# Altium project BPod Panel Due.PrjPcb
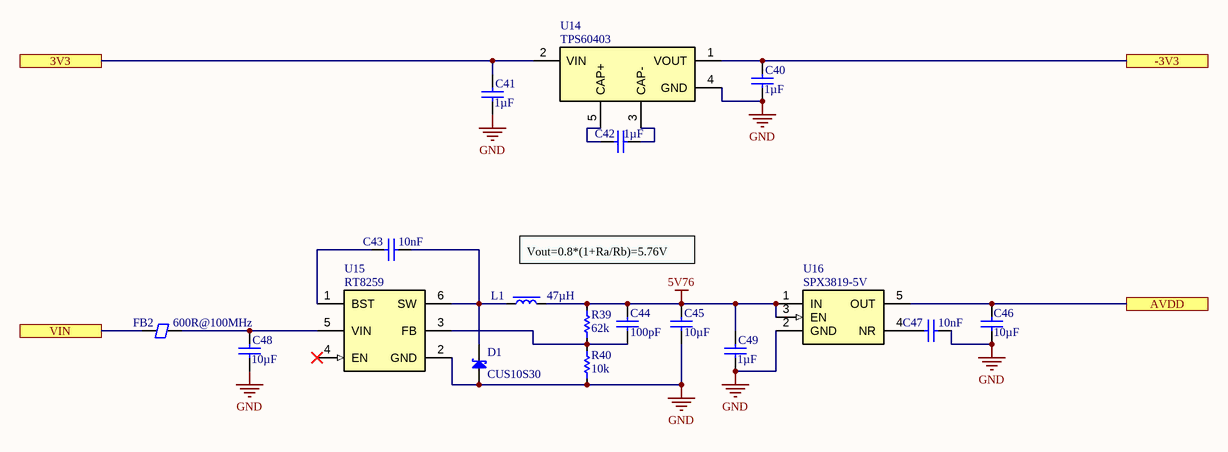
[diagram p0: DC DC.SchDoc]
Project: BPod Panel Due
8 sheets, 274 parts. Net scope: hierarchical (ports join the sheet entries above them; power ports are global).
Board file: BPod Panel Due.PcbDoc
Sheets:
  DC DC.SchDoc
  BPod Panel Due.SchDoc
    DAC Output = DAC Output.SchDoc
    Analog Input A = Analog Input.SchDoc
      Analog Input0 = Analog Input Connector.SchDoc
      Analog Input1 = Analog Input Connector.SchDoc
      Analog Input2 = Analog Input Connector.SchDoc
      Analog Input3 = Analog Input Connector.SchDoc
      Analog Input4 = Analog Input Connector.SchDoc
      Analog Input5 = Analog Input Connector.SchDoc
    Analog Input B = Analog Input.SchDoc
      Analog Input0 = Analog Input Connector.SchDoc
      Analog Input1 = Analog Input Connector.SchDoc
      Analog Input2 = Analog Input Connector.SchDoc
      Analog Input3 = Analog Input Connector.SchDoc
      Analog Input4 = Analog Input Connector.SchDoc
      Analog Input5 = Analog Input Connector.SchDoc
    Digital IO HS = Digital IO HS.SchDoc
    DAC Amplifier = DAC Amplifier.SchDoc
    DAC Offset = DAC Offset.SchDoc

## Sheet DC DC.SchDoc
size 297 x 209 mm; CompanyName: Sainsbury Wellcome Centre; Organization: FabLab; Address1: Sainsbury Wellcome Centre; Address2: 25 Howland Street; Address3: London; Address4: W1T 4JG; DocumentNumber: 4; SheetNumber: 4; SheetTotal: 12; swcgroup: FabLab; Org: Sainsbury Wellcome Centre; Add1: 25 Howland Street; Add2: London; Add3: W1T 4JG; WebAddress: www.sainsburywellcome.org; SheetSize: A4; SheetName: Level Shifter

### Parts
C40  value 1µF  [CAP_CHIP_0603]  (hidden comment: C0603-1uF-50V)
C41  value 1µF  [CAP_CHIP_0603]  (hidden comment: C0603-1uF-50V)
C42  value 1µF  [CAP_CHIP_0603]  (hidden comment: C0603-1uF-50V)
C43  value 10nF  [CAP_CHIP_0603]  (hidden comment: C0603-10nF-50V)
C44  value 100pF  [CAP_CHIP_0603]  (hidden comment: C0603-100pF-50V)
C45  value 10µF  [CAP_CHIP_0603]  (hidden comment: C0603-10uF-35V)
C46  value 10µF  [CAP_CHIP_0603]  (hidden comment: C0603-10uF-25V)
C47  value 10nF  [CAP_CHIP_0603]  (hidden comment: C0603-10nF-50V)
C48  value 10µF  [CAP_CHIP_0603]  (hidden comment: C0603-10uF-35V)
C49  value 1µF  [CAP_CHIP_0603]  (hidden comment: C0603-1uF-50V)
D1  CUS10S30  [SOD323]
FB2  value 600R@100MHz  [FB_CHIP_0805]  (hidden comment: FB0805-600R-0.5A)
L1  value 47µH  [IND_PWR_1210]  (hidden comment: L-PWR-47uH-0.3A)
R39  value 62k  [RES_CHIP_0603]  (hidden comment: R0603-62K)
R40  value 10k  [RES_CHIP_0603]  (hidden comment: R0603-10K)
U14  TPS60403  [SOT23-5]
U15  RT8259  [SOT23-6]
U16  SPX3819-5V  [SOT23-5]

### Ports
3V3, -3V3, AVDD, VIN

### Nets
5V76: C44.2 C45.2 C49.1 L1.2 R39.2 U16.1(IN) U16.3(EN)
GND: C40.2 C41.2 C45.1 C46.1 C47.1 C48.1 C49.2 D1.2(A) R40.1 U14.4(GND) U15.2(GND) U16.2(GND)
NetC40_1: C40.1 U14.1(VOUT) ; port -3V3
NetC41_1: C41.1 U14.2(VIN) ; port 3V3
NetC42_1: C42.1 U14.5(CAP+)
NetC42_2: C42.2 U14.3(CAP-)
NetC43_1: C43.1 D1.1(C) L1.1 U15.6(SW)
NetC43_2: C43.2 U15.1(BST)
NetC44_1: C44.1 R39.1 R40.2 U15.3(FB)
NetC46_2: C46.2 U16.5(OUT) ; port AVDD
NetC47_2: C47.2 U16.4(NR)
NetC48_2: C48.2 FB2.2 U15.5(VIN)
NetFB2_1: FB2.1 ; port VIN

Not connected (* = marked no-connect by the designer): U15 4(EN)*

### Notes on the sheet
- Vout=0.8*(1+Ra/Rb)=5.76V
- FILE
- VARIANT
- DATE
- REVISION
- SHEET
- /
- PROJECT
- SIZE

### Library data of the parts
C40-C42 C49 = CMP-611-0033-11: 0603 Multilayer Ceramic Capacitors MLCC; PartNumber: CL10A105KB8NNNC; Pick&PlaceFootprint: C0603; Voltage Rating: 50V; Dielectric: X5R; Tolerance: 10%; Case/Package: 0603; LCSC Part N.: C15849; RoHS: Yes; Mount: SMD; Capacitor Type: Ceramic
C43 C47 = CMP-611-0022-7: 0603 Multilayer Ceramic Capacitors MLCC; PartNumber: 0603B103K500NT; Tolerance: 10%; Voltage Rating: 50V; Pick&PlaceFootprint: C0603; Dielectric: X7R; RoHS: Yes; Capacitor Type: Ceramic; Mount: SMD; Case/Package: 0603; LCSC Part N.: C57112
C44 = CMP-611-0038-6: 0603 Multilayer Ceramic Capacitors MLCC; PartNumber: CL10C101JB8NNNC; Pick&PlaceFootprint: C0603; Tolerance: 5%; Voltage Rating: 50V; Dielectric: C0G; Case/Package: 0603; LCSC Part N.: C14858; Capacitor Type: Ceramic; Mount: SMD; RoHS: Yes
C45 C48 = CMP-611-0048-3: Ceramic Capacitor, Multilayer, Ceramic, 35V, 20% +Tol, 20% -Tol, X5R, 15% TC, 10uF, Surface Mount, 0603; PartNumber: GRM188R6YA106MA73D; Pick&PlaceFootprint: C0603; Dielectric: X5R; Capacitor Type: Ceramic; Mount: SMD; LCSC Part N.: C194427; RoHS: Yes; Tolerance: 20%; Voltage Rating: 35V; Case/Package: 0603
C46 = CMP-611-0050-6: 0603 Multilayer Ceramic Capacitors MLCC; PartNumber: CL10A106MA8NRNC; Dielectric: X5R; Pick&PlaceFootprint: C0603; Voltage Rating: 25V; Tolerance: 20%; Case/Package: 0603; LCSC Part N.: C96446; RoHS: Yes; Capacitor Type: Ceramic; Mount: SMD
D1 = CMP-821-0013-3: Rectifier Diode, Schottky, 1 Phase, 1 Element, 1A, 30V V(RRM), Silicon; PartNumber: CUS10S30,H3F; Forward Voltage: 370mV; LCSC Part N.: C146335; Max Reverse Voltage: 30V; Mount: Surface Mount; Pick&PlaceFootprint: SOD323; Forward Current: 1A
FB2 = CMP-600-0000-6: Ferrite Chip, 1 Function(s), 0.5A, 2 Pin(s); PartNumber: GZ2012D601TF; DC Resistance-Max: 300mR; Current Rating: 500mA; Footprint: 0805; LCSC Part N.: C1017
L1 = CMP-620-0005-6: Inductor Power Chip Shielded Wirewound 47uH 20% 1MHz Ferrite 0.5A 0.9Ohm DCR 1210 Automotive T/R; PartNumber: LQW32FT470M0HL; RMS Current (Irms): 500mA; Saturation Current: 300mA; DC Resistance (DCR): 900mR; Tolerance: 20%; LCSC Part N.: C907956
R39 = CMP-633-0150-1: 100mW Thick Film Resistors 75V ±100ppm/℃ ±1% 0603 Chip Resistor; PartNumber: 0603WAF6202T5E; Pick&PlaceFootprint: R0603; Number of Resistors: 1; Mount: Surface Mount; Power Rating: 100mW; Tolerance: 1%; Voltage Rating: 75V; Case/Package: 0603; LCSC Part N.: C23221
R40 = CMP-633-0002-26: 100mW Thick Film Resistors 75V ±100ppm/℃ ±1% 0603 Chip Resistor; PartNumber: 0603WAF1002T5E; Number of Resistors: 1; Pick&PlaceFootprint: R0603; Case/Package: 0603; Voltage Rating: 75V; Power Rating: 100mW; LCSC Part N.: C25804; Tolerance: 1%; Mount: Surface Mount
U14 = CMP-970-0067-1: 60mA Charge Pump Voltage Inverter with Fixed 250kHz Operation 5-SOT-23 -40 to 85; PartNumber: TPS60403DBVR; Min Output Voltage: -1.8V; Min Input Voltage: 1.8V; Max Input Voltage: 5.25V; Switcher Configuration: Charge Pump; LCSC Part N.: C11338; Max Output current: 60mA; Switching Frequency: 250kHz
U15 = CMP-970-0044-2: Step-down type Adjustable 800mV~15V 1.2A 4.5V~24V Switching Regulator/Controller; PartNumber: RT8259GJ6; Min Input Voltage: 4.5V; RDS(On): 300mR; Reference Voltage: 0.8V; Switcher Configuration: BUCK; Switching Frequency: 1.4MHz; Max Input Voltage: 24V; Max Output Voltage: 15V; LCSC Part N.: C425775; Pick&PlaceFootprint: SOT23-6; Max Output current: 1.2A
U16 = CMP-970-0066-1: 500mA 70dB Fixed 3.3V Positive electrode 16V LDO; PartNumber: SPX3819M5-L-5-0/TR; Accuracy: 1%; Max Output Current: 800mA; Min Input Voltage: 2.5V; Output Noise: 40uV; Load Regulation: 0.05%; Output Voltage: 5V; Dropout Voltage: 340mV; Quiescent Current: 8uA; Line Regulation: 0.04%; Max Supply Voltage: 16V; PSRR: 70dB; Max Input Voltage: 16V; Output Current: 500mA; LCSC Part N.: C13417; Output Type: Fixed; Pick&PlaceFootprint: SOT23-5

## Sheet BPod Panel Due.SchDoc
size 297 x 209 mm; CompanyName: Sainsbury Wellcome Centre; Organization: FabLab; Address1: Sainsbury Wellcome Centre; Address2: 25 Howland Street; Address3: London; Address4: W1T 4JG; DocumentNumber: 1; SheetNumber: 1; SheetTotal: 12; swcgroup: FabLab; Org: Sainsbury Wellcome Centre; Add1: 25 Howland Street; Add2: London; Add3: W1T 4JG; WebAddress: www.sainsburywellcome.org; SheetSize: A4; SheetName: BPod Panel Due
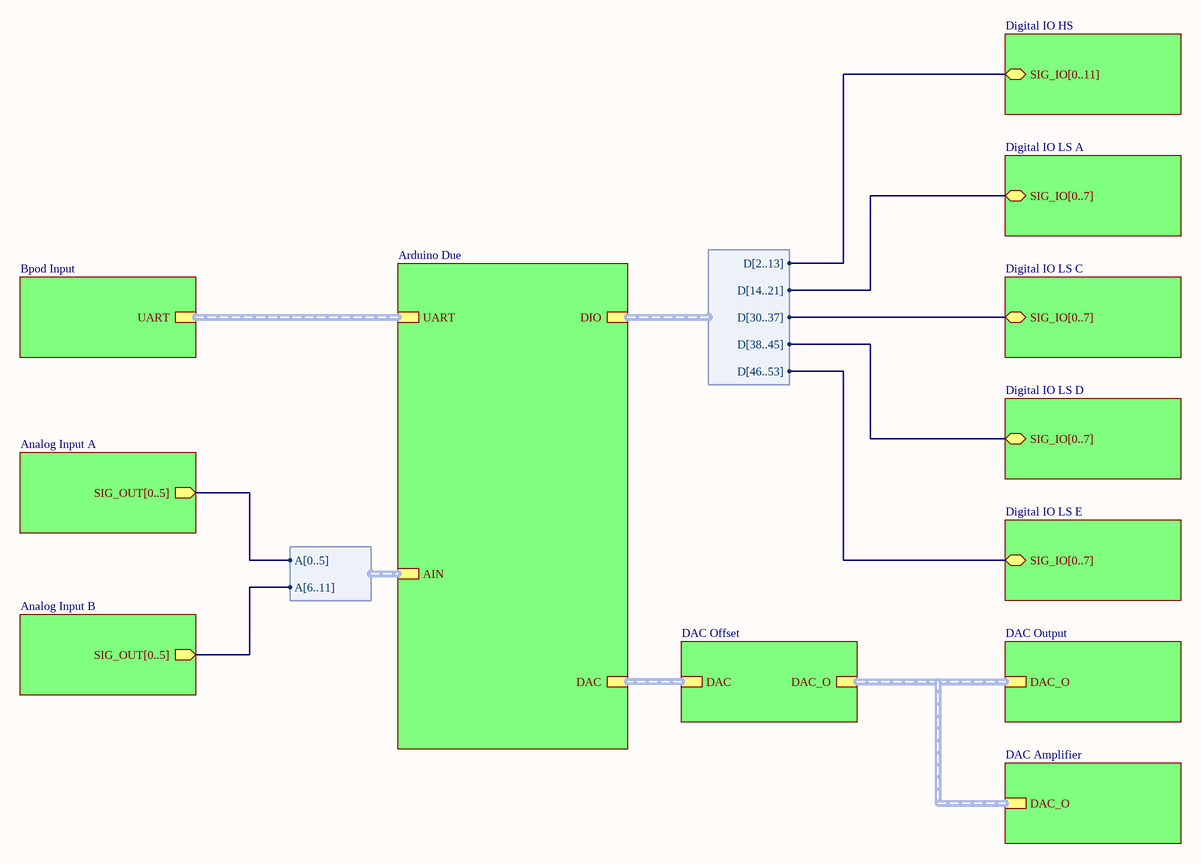
[diagram p1: BPod Panel Due.SchDoc]

### Sub-sheets
Analog Input A = Analog Input.SchDoc: SIG_OUT[0..5] (out)
Analog Input B = Analog Input.SchDoc: SIG_OUT[0..5] (out)
Arduino Due = Arduino Due.SchDoc (file not in this document): AIN (harness AIN), DAC (harness DAC), DIO (harness DIO), UART (harness UART)
Bpod Input = Bpod Input.SchDoc (file not in this document): UART (harness UART)
DAC Amplifier = DAC Amplifier.SchDoc: DAC_O (harness DAC_O)
DAC Offset = DAC Offset.SchDoc: DAC (harness DAC), DAC_O (harness DAC_O)
DAC Output = DAC Output.SchDoc: DAC_O (harness DAC_O)
Digital IO HS = Digital IO HS.SchDoc: SIG_IO[0..11] (bidir)
Digital IO LS A = Digital IO LS.SchDoc (file not in this document): SIG_IO[0..7] (bidir)
Digital IO LS C = Digital IO LS.SchDoc (file not in this document): SIG_IO[0..7] (bidir)
Digital IO LS D = Digital IO LS.SchDoc (file not in this document): SIG_IO[0..7] (bidir)
Digital IO LS E = Digital IO LS.SchDoc (file not in this document): SIG_IO[0..7] (bidir)

### Harnesses
AIN: A[6..11], A[0..5]
DIO: D[2..13], D[14..21], D[30..37], D[38..45], D[46..53]

### Buses and harness runs
harness sheet Arduino Due/DAC = sheet DAC Offset/DAC
harness sheet Arduino Due/UART = sheet Bpod Input/UART
harness sheet DAC Amplifier/DAC_O = sheet DAC Offset/DAC_O = sheet DAC Output/DAC_O

### Notes on the sheet
- FILE
- VARIANT
- DATE
- REVISION
- SHEET
- /
- PROJECT
- SIZE

## Sheet DAC Output.SchDoc
size 297 x 209 mm; CompanyName: Sainsbury Wellcome Centre; Organization: FabLab; Address1: Sainsbury Wellcome Centre; Address2: 25 Howland Street; Address3: London; Address4: W1T 4JG; DocumentNumber: 11; SheetNumber: 11; SheetTotal: 12; swcgroup: FabLab; Org: Sainsbury Wellcome Centre; Add1: 25 Howland Street; Add2: London; Add3: W1T 4JG; WebAddress: www.sainsburywellcome.org; SheetSize: A4; SheetName: Level Shifter
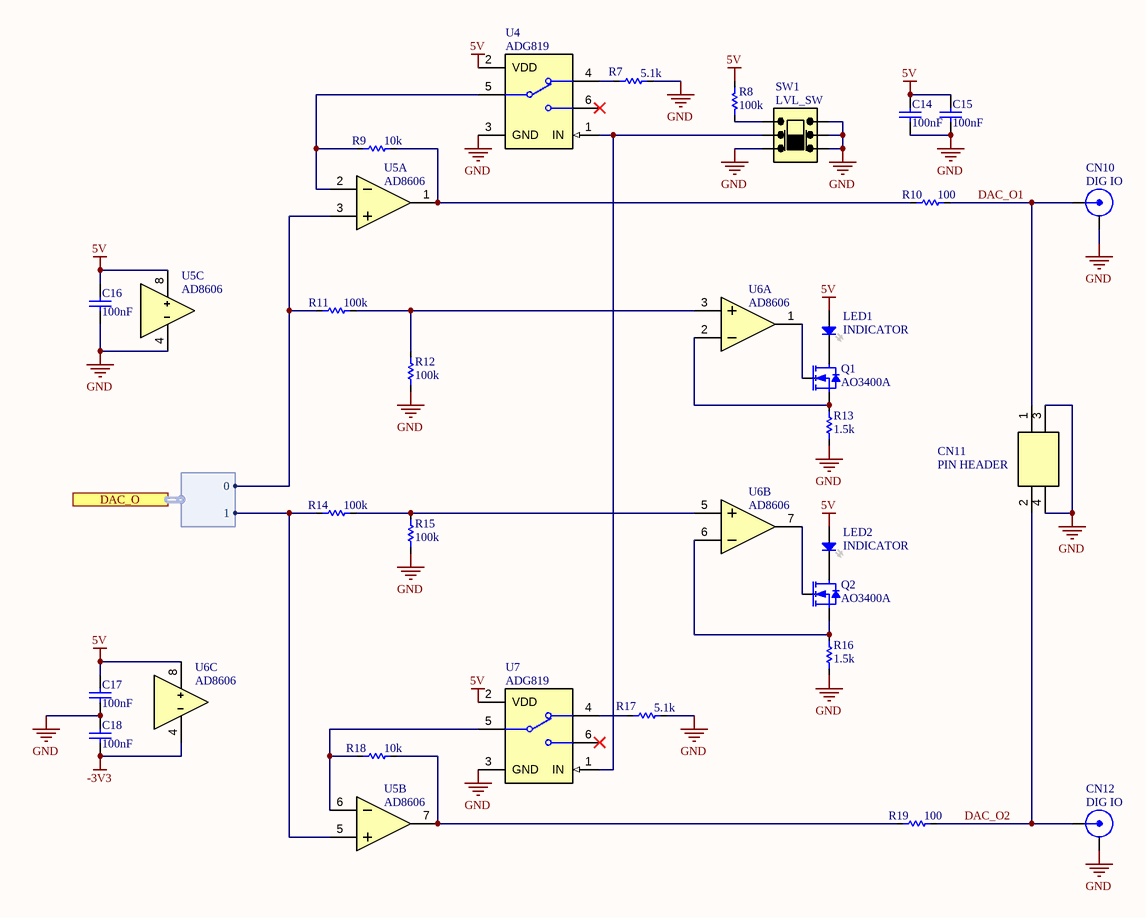
[diagram p2: DAC Output.SchDoc]

### Parts
C14  value 100nF  [CAP_CHIP_0603]  (hidden comment: C0603-100nF-50V)
C15  value 100nF  [CAP_CHIP_0603]  (hidden comment: C0603-100nF-50V)
C16  value 100nF  [CAP_CHIP_0603]  (hidden comment: C0603-100nF-50V)
C17  value 100nF  [CAP_CHIP_0603]  (hidden comment: C0603-100nF-50V)
C18  value 100nF  [CAP_CHIP_0603]  (hidden comment: C0603-100nF-50V)
CN10  DIG IO  [BNC-AMP-112515]
CN11  PIN HEADER  [PIN_2.54_2X2P]
CN12  DIG IO  [BNC-AMP-112515]
LED1  INDICATOR  [LED_CHIP_0805]
LED2  INDICATOR  [LED_CHIP_0805]
Q1  AO3400A  [SOT23]
Q2  AO3400A  [SOT23]
R7  value 5.1k  [RES_CHIP_0603]  (hidden comment: R0603-5K1)
R8  value 100k  [RES_CHIP_0603]  (hidden comment: R0603-100K)
R9  value 10k  [RES_CHIP_0603]  (hidden comment: R0603-10K)
R10  value 100  [RES_CHIP_0603]  (hidden comment: R0603-100R)
R11  value 100k  [RES_CHIP_0603]  (hidden comment: R0603-100K)
R12  value 100k  [RES_CHIP_0603]  (hidden comment: R0603-100K)
R13  value 1.5k  [RES_CHIP_0603]  (hidden comment: R0603-1K5)
R14  value 100k  [RES_CHIP_0603]  (hidden comment: R0603-100K)
R15  value 100k  [RES_CHIP_0603]  (hidden comment: R0603-100K)
R16  value 1.5k  [RES_CHIP_0603]  (hidden comment: R0603-1K5)
R17  value 5.1k  [RES_CHIP_0603]  (hidden comment: R0603-5K1)
R18  value 10k  [RES_CHIP_0603]  (hidden comment: R0603-10K)
R19  value 100  [RES_CHIP_0603]  (hidden comment: R0603-100R)
SW1  LVL_SW  [SW_SLIDE_OS202013MT8]
U4  ADG819  [SOT23-6]
U5  AD8606  [VSSOP8_3X3_0.65E]  (parts A,B,C of 3)
U6  AD8606  [VSSOP8_3X3_0.65E]  (parts A,B,C of 3)
U7  ADG819  [SOT23-6]

### Ports
DAC_O (harness DAC_O)

### Harnesses
DAC_O: 1, 0

### Nets
5V: C14.2 C15.2 C16.2 C17.2 LED1.2(A) LED2.2(A) R8.2 U4.2(VDD) U5.8(V+) U6.8(V+) U7.2(VDD)
-3V3: C18.1 U6.4(V-)
GND: C14.1 C15.1 C16.1 C17.1 C18.2 CN10.2(GND) CN11.3 CN11.4 CN12.2(GND) R7.2 R12.1 R13.1 R15.1 R16.1 R17.2 SW1.1(NCA) SW1.4(NCB) SW1.5(COMB) SW1.6(NOB) U4.3(GND) U5.4(V-) U7.3(GND)
DAC_O1: CN10.1(SIG) CN11.1 R10.2
DAC_O2: CN11.2 CN12.1(SIG) R19.2
DAC_O.0: R11.2 U5.3(A+) ; port DAC_O.0
DAC_O.1: R14.2 U5.5(B+) ; port DAC_O.1
NetLED1_1: LED1.1(K) Q1.3(D)
NetLED2_1: LED2.1(K) Q2.3(D)
NetQ1_1: Q1.1(G) U6.1(AOUT)
NetQ1_2: Q1.2(S) R13.2 U6.2(A-)
NetQ2_1: Q2.1(G) U6.7(BOUT)
NetQ2_2: Q2.2(S) R16.2 U6.6(B-)
NetR7_1: R7.1 U4.4(S1)
NetR8_1: R8.1 SW1.3(NOA)
NetR9_1: R9.1 U4.5(D) U5.2(A-)
NetR9_2: R9.2 R10.1 U5.1(AOUT)
NetR11_1: R11.1 R12.2 U6.3(A+)
NetR14_1: R14.1 R15.2 U6.5(B+)
NetR17_1: R17.1 U7.4(S1)
NetR18_1: R18.1 U5.6(B-) U7.5(D)
NetR18_2: R18.2 R19.1 U5.7(BOUT)
NetSW1_2: SW1.2(COMA) U4.1(IN) U7.1(IN)

Not connected (* = marked no-connect by the designer): U4 6(S2)*; U7 6(S2)*

### Notes on the sheet
- FILE
- VARIANT
- DATE
- REVISION
- SHEET
- /
- PROJECT
- SIZE

### Library data of the parts
C14-C18 = CMP-611-0027-24: 0603 Multilayer Ceramic Capacitors MLCC; PartNumber: CC0603KRX7R9BB104; Tolerance: 10%; Pick&PlaceFootprint: C0603; Dielectric: X7R; Voltage Rating: 50V; Capacitor Type: Ceramic; RoHS: Yes; Mount: SMD; LCSC Part N.: C14663; Case/Package: 0603
CN10 CN12 = CMP-730-0003-11: RF BNC Connector, Female, Board Mount, Solder Terminal, Jack; PartNumber: 112515; Clock Frequency: 4GHz; Characteristic Impedance: 50R; LCSC Part N.: C3176191; Orientation: Straight; Connector Type: BNC; Gender: Female
CN11 = CMP-380-0037-5: Straight Policy 2.5mm 6mm -40℃~+105℃ 3mm 2.54mm Double Row Black Brass 2.54mm Plugin,P=2.54mm Pin Headers; PartNumber: PZ254V-12-4P; Gender: Male; Number of Contacts: 4; Number of Positions: 2; Pitch: 2.54mm; Number of Rows: 2; Mount: Through Hole; Orientation: Straight; LCSC Part N.: C492419
LED1 LED2 = CMP-520-0018-2: White 0805 Light Emitting Diodes (LED) ROHS; PartNumber: KT-0805W; Forward Current: 25mA; Wavelength: 405nm; Pick&PlaceFootprint: LED0805; Forward Voltage: 2.9V; Colour: White; LCSC Part N.: C34499; Mount: Surface Mount
Q1 Q2 = CMP-810-0002-2: 30V 5.7A 26.5mΩ@10V,5.7A 1.4W 1.5V@250uA 1 NChannel SOT-23-3L MOSFETs; Gate-Source Voltage (Vgs): 12V; Pick&PlaceFootprint: SOT-23; RDS(ON): 26.5mR; Switching Time: 34.5ns; LCSC Part N.: C20917; Drain-Source Voltage (Vds): 30V; Mount: Surface Mount; PartNumber: AO3400A; Power Dissipation: 1.4W; Drain Current (Id): 5.7A; Polarity: N Channel
R7 R17 = CMP-633-0090-12: 100mW Thick Film Resistors 75V ±100ppm/℃ ±1% 0603 Chip Resistor; PartNumber: 0603WAF5101T5E; Number of Resistors: 1; Pick&PlaceFootprint: R0603; Voltage Rating: 75V; Case/Package: 0603; Power Rating: 100mW; Tolerance: 1%; LCSC Part N.: C23186; Mount: Surface Mount
R8 R11 R12 R14 R15 = CMP-633-0000-28: 100mW Thick Film Resistors 75V ±100ppm/℃ ±1% 0603 Chip Resistor; PartNumber: 0603WAF1003T5E; Number of Resistors: 1; Pick&PlaceFootprint: R0603; LCSC Part N.: C25803; Mount: Surface Mount; Voltage Rating: 75V; Power Rating: 100mW; Case/Package: 0603; Tolerance: 1%
R9 R18 = CMP-633-0002-26: as R40 on sheet DC DC; Case/Package: 0603; Voltage Rating: 75V; Power Rating: 100mW; LCSC Part N.: C25804; Tolerance: 1%; Mount: Surface Mount
R10 R19 = CMP-633-0094-12: 100mW Thick Film Resistors 75V ±100ppm/℃ ±1% 0603 Chip Resistor; PartNumber: 0603WAF1000T5E; Number of Resistors: 1; Pick&PlaceFootprint: R0603; Case/Package: 0603; Voltage Rating: 75V; Mount: Surface Mount; Tolerance: 1%; LCSC Part N.: C22775; Power Rating: 100mW
R13 R16 = CMP-633-0029-25: 100mW Thick Film Resistors 75V ±100ppm/℃ ±1% 0603 Chip Resistor; PartNumber: 0603WAF1501T5E; Number of Resistors: 1; Pick&PlaceFootprint: R0603; Voltage Rating: 75V; Tolerance: 1%; Mount: Surface Mount; Case/Package: 0603; LCSC Part N.: C22843; Power Rating: 100mW
SW1 = CMP-B00-0028-1: Switch Slide ON ON DPDT Top Slide 0.3A 30VDC 10000Cycles PC Pins Thru-Hole Bulk; PartNumber: OS202013MT8QN1; Switch Travel: 3.2mm; Switch Function: On-On; Voltage Rating (DC): 30V; Throw Configuration: DPDT; Orientation: Straight; LCSC Part N.: C2799227
U4 U7 = CMP-9A0-0003-1: Analog Switch/Analog Multiplexer Single 2: 1 Automotive 6-Pin SOT-23 T/R; PartNumber: ADG819BRTZ-REEL7; Throw Configuration: SPDT; On-State Resistance: 600mR; Number of Channels: 1; Max Supply Voltage: 5.5V; Min Supply Voltage: 1.8V; Bandwidth: 17MHz; LCSC Part N.: C579118
U5 U6 = CMP-941-0002-4: Operational Amplifier, 2 Func, 750uV Offset-Max, CMOS, PDSO8; PartNumber: AD8606ARMZ-REEL; Pick&PlaceFootprint: MSOP-8; Slew Rate: 5V/µs; Min Supply Voltage: 0V; Input Offset Voltage: 65µV; CMRR: 100dB; Max Supply Voltage: 5V; Voltage Drift: 4.5µV/°C; PSRR: 95dB; Quiescent Current: 1mA; Max Supply Current: 80mA; Gain Bandwidth: 10MHz; LCSC Part N.: C459905

## Sheet Analog Input.SchDoc
size 297 x 209 mm; CompanyName: Sainsbury Wellcome Centre; Organization: FabLab; Address1: Sainsbury Wellcome Centre; Address2: 25 Howland Street; Address3: London; Address4: W1T 4JG; DocumentNumber: 5; SheetNumber: 5; SheetTotal: 12; swcgroup: FabLab; Org: Sainsbury Wellcome Centre; Add1: 25 Howland Street; Add2: London; Add3: W1T 4JG; WebAddress: www.sainsburywellcome.org; SheetSize: A4; SheetName: Analog Input A
Used 2 times, as channels Analog Input A, Analog Input B. Parts and nets are listed once, with the designators drawn on the sheet.
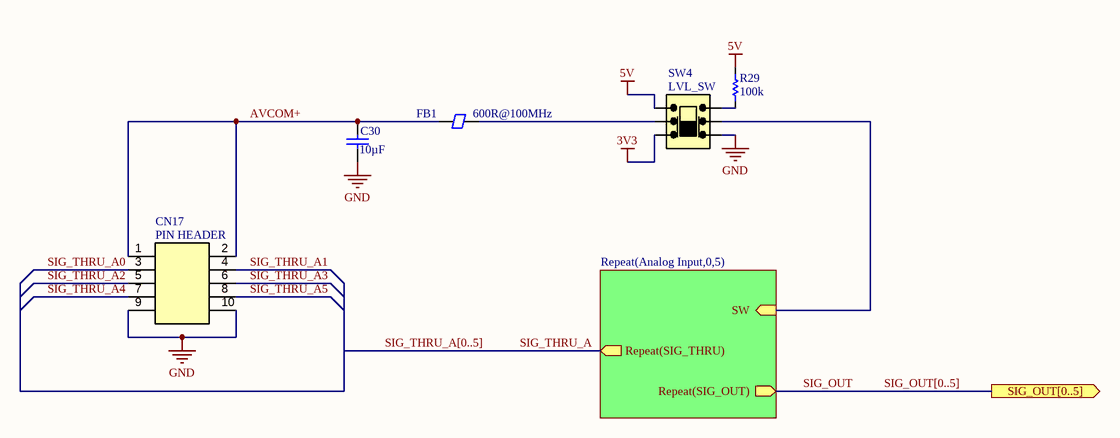
[diagram p3: Analog Input.SchDoc]

### Parts
C30  value 10µF  [CAP_CHIP_0603]  (hidden comment: C0603-10uF-35V)
CN17  PIN HEADER  [PIN_2.54_2X5P]
FB1  value 600R@100MHz  [FB_CHIP_0603]  (hidden comment: FB0603-600R-0.2A)
R29  value 100k  [RES_CHIP_0603]  (hidden comment: R0603-100K)
SW4  LVL_SW  [SW_SLIDE_OS202013MT8]

### Sub-sheets
Repeat(Analog Input,0,5) = Analog Input Connector.SchDoc: SW (in), Repeat(SIG_OUT) (out), Repeat(SIG_THRU) (out)

### Ports
SIG_OUT[0..5] (out)

### Nets
3V3: SW4.4(NCB)
5V: R29.2 SW4.6(NOB)
GND: C30.1 CN17.9 CN17.10 SW4.1(NCA)
AVCOM+: C30.2 CN17.1 CN17.2 FB1.2
SIG_OUT: sheet Repeat(Analog Input,0,5)/Repeat(SIG_OUT)
SIG_THRU_A: sheet Repeat(Analog Input,0,5)/Repeat(SIG_THRU)
SIG_THRU_A0: CN17.3
SIG_THRU_A1: CN17.4
SIG_THRU_A2: CN17.5
SIG_THRU_A3: CN17.6
SIG_THRU_A4: CN17.7
SIG_THRU_A5: CN17.8
NetFB1_1: FB1.1 SW4.5(COMB)
NetR29_1: R29.1 SW4.3(NOA)
NetSW4_2: SW4.2(COMA) ; sheet Repeat(Analog Input,0,5)/SW

### Channels
Analog Input A: designators end in _1
Analog Input B: designators end in _2

### Buses and harness runs
bus SIG_OUT[0..5] = port SIG_OUT[0..5]
bus SIG_THRU_A[0..5]

### Notes on the sheet
- FILE
- VARIANT
- DATE
- REVISION
- SHEET
- /
- PROJECT
- SIZE

### Library data of the parts
C30 = CMP-611-0048-3: as C45 on sheet DC DC; Dielectric: X5R; Capacitor Type: Ceramic; Mount: SMD; LCSC Part N.: C194427; RoHS: Yes; Tolerance: 20%; Voltage Rating: 35V; Case/Package: 0603
CN17 = CMP-380-0034-5: Straight Policy 2.5mm 6mm -40℃~+105℃ 3mm 2.54mm Double Row Black Brass 2.54mm Plugin,P=2.54mm Pin Headers; PartNumber: PZ254V-12-10P; Number of Positions: 5; Number of Contacts: 10; Gender: Male; Orientation: Straight; Pitch: 2.54mm; LCSC Part N.: C492422; Number of Rows: 2; Mount: Through Hole
FB1 = CMP-600-0001-6: Ferrite Chip, 1 Function(s), 0.2A, 2 Pin(s); PartNumber: GZ1608D601TF; Current Rating: 200mA; DC Resistance-Max: 450mR; Footprint: 0603; LCSC Part N.: C1002
R29 = CMP-633-0000-28: as R8 on sheet DAC Output; LCSC Part N.: C25803; Mount: Surface Mount; Voltage Rating: 75V; Power Rating: 100mW; Case/Package: 0603; Tolerance: 1%
SW4 = CMP-B00-0028-1: as SW1 on sheet DAC Output; Throw Configuration: DPDT; Orientation: Straight; LCSC Part N.: C2799227

## Sheet Analog Input Connector.SchDoc
size 297 x 209 mm; CompanyName: Sainsbury Wellcome Centre; Organization: FabLab; Address1: Sainsbury Wellcome Centre; Address2: 25 Howland Street; Address3: London; Address4: W1T 4JG; DocumentNumber: 6; SheetNumber: 6; SheetTotal: 12; swcgroup: FabLab; Org: Sainsbury Wellcome Centre; Add1: 25 Howland Street; Add2: London; Add3: W1T 4JG; WebAddress: www.sainsburywellcome.org; SheetSize: A4; SheetName: Analog Input A
Used 12 times, as channels Analog Input A/Analog Input0, Analog Input A/Analog Input1, Analog Input A/Analog Input2, Analog Input A/Analog Input3, Analog Input A/Analog Input4, Analog Input A/Analog Input5, Analog Input B/Analog Input0, Analog Input B/Analog Input1, Analog Input B/Analog Input2, Analog Input B/Analog Input3, Analog Input B/Analog Input4, Analog Input B/Analog Input5. Parts and nets are listed once, with the designators drawn on the sheet.
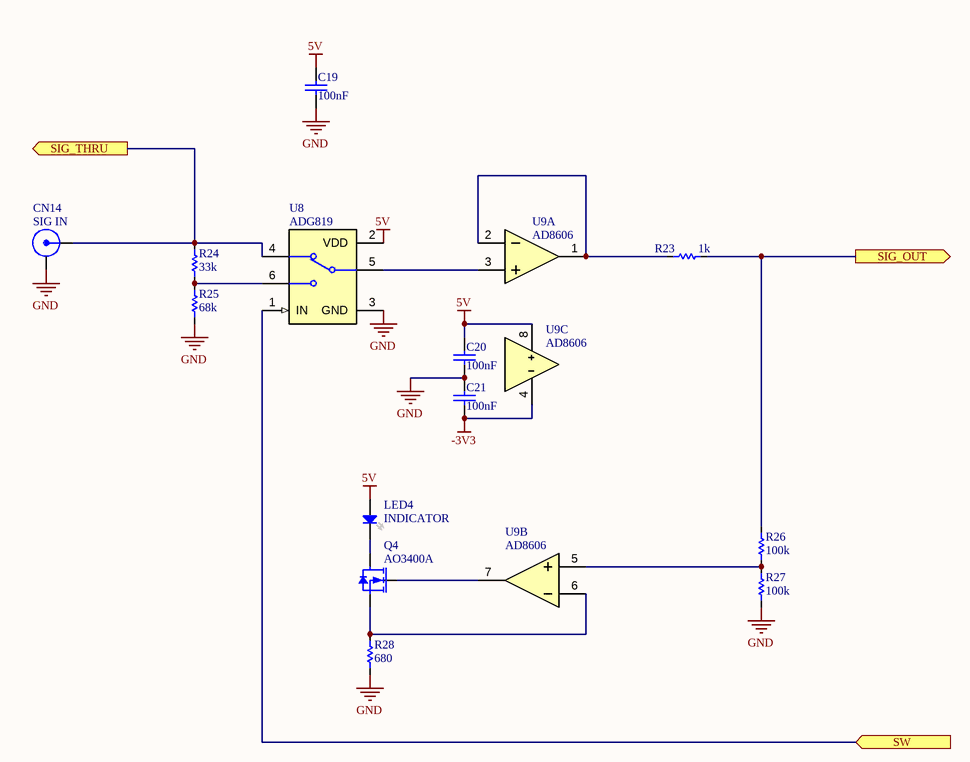
[diagram p4: Analog Input Connector.SchDoc]

### Parts
C19  value 100nF  [CAP_CHIP_0603]  (hidden comment: C0603-100nF-50V)
C20  value 100nF  [CAP_CHIP_0603]  (hidden comment: C0603-100nF-50V)
C21  value 100nF  [CAP_CHIP_0603]  (hidden comment: C0603-100nF-50V)
CN14  SIG IN  [BNC-AMP-112515]
LED4  INDICATOR  [LED_CHIP_0805]
Q4  AO3400A  [SOT23]
R23  value 1k  [RES_CHIP_0603]  (hidden comment: R0603-1K)
R24  value 33k  [RES_CHIP_0603]  (hidden comment: R0603-33K)
R25  value 68k  [RES_CHIP_0603]  (hidden comment: R0603-68K)
R26  value 100k  [RES_CHIP_0603]  (hidden comment: R0603-100K)
R27  value 100k  [RES_CHIP_0603]  (hidden comment: R0603-100K)
R28  value 680  [RES_CHIP_0603]  (hidden comment: R0603-680R)
U8  ADG819  [SOT23-6]
U9  AD8606  [VSSOP8_3X3_0.65E]  (parts A,B,C of 3)

### Ports
SIG_OUT (out), SIG_THRU (out), SW (in)

### Nets
5V: C19.2 C20.2 LED4.2(A) U8.2(VDD) U9.8(V+)
-3V3: C21.1 U9.4(V-)
GND: C19.1 C20.1 C21.2 CN14.2(GND) R25.1 R27.1 R28.1 U8.3(GND)
SIG_OUT: R23.2 R26.2 ; port SIG_OUT
SIG_THRU: CN14.1(SIG) R24.2 U8.4(S1) ; port SIG_THRU
SW: U8.1(IN) ; port SW
NetLED4_1: LED4.1(K) Q4.3(D)
NetQ4_1: Q4.1(G) U9.7(BOUT)
NetQ4_2: Q4.2(S) R28.2 U9.6(B-)
NetR23_1: R23.1 U9.1(AOUT) U9.2(A-)
NetR24_1: R24.1 R25.2 U8.6(S2)
NetR26_1: R26.1 R27.2 U9.5(B+)
NetU8_5: U8.5(D) U9.3(A+)

### Channels
Analog Input A/Analog Input0: designators end in _1; ports SIG_OUT=SIG_OUT0_Analog Input A SIG_THRU=SIG_THRU_A0_Analog Input A SW=NetSW4_1_2
Analog Input A/Analog Input1: designators end in _2; ports SIG_OUT=SIG_OUT1_Analog Input A SIG_THRU=SIG_THRU_A1_Analog Input A SW=NetSW4_1_2
Analog Input A/Analog Input2: designators end in _3; ports SIG_OUT=SIG_OUT2_Analog Input A SIG_THRU=SIG_THRU_A2_Analog Input A SW=NetSW4_1_2
Analog Input A/Analog Input3: designators end in _4; ports SIG_OUT=SIG_OUT3_Analog Input A SIG_THRU=SIG_THRU_A3_Analog Input A SW=NetSW4_1_2
Analog Input A/Analog Input4: designators end in _5; ports SIG_OUT=SIG_OUT4_Analog Input A SIG_THRU=SIG_THRU_A4_Analog Input A SW=NetSW4_1_2
Analog Input A/Analog Input5: designators end in _6; ports SIG_OUT=SIG_OUT5_Analog Input A SIG_THRU=SIG_THRU_A5_Analog Input A SW=NetSW4_1_2
Analog Input B/Analog Input0: designators end in _7; ports SIG_OUT=SIG_OUT0_Analog Input B SIG_THRU=SIG_THRU_A0_Analog Input B SW=NetSW4_2_2
Analog Input B/Analog Input1: designators end in _8; ports SIG_OUT=SIG_OUT1_Analog Input B SIG_THRU=SIG_THRU_A1_Analog Input B SW=NetSW4_2_2
Analog Input B/Analog Input2: designators end in _9; ports SIG_OUT=SIG_OUT2_Analog Input B SIG_THRU=SIG_THRU_A2_Analog Input B SW=NetSW4_2_2
Analog Input B/Analog Input3: designators end in _10; ports SIG_OUT=SIG_OUT3_Analog Input B SIG_THRU=SIG_THRU_A3_Analog Input B SW=NetSW4_2_2
Analog Input B/Analog Input4: designators end in _11; ports SIG_OUT=SIG_OUT4_Analog Input B SIG_THRU=SIG_THRU_A4_Analog Input B SW=NetSW4_2_2
Analog Input B/Analog Input5: designators end in _12; ports SIG_OUT=SIG_OUT5_Analog Input B SIG_THRU=SIG_THRU_A5_Analog Input B SW=NetSW4_2_2

### Notes on the sheet
- FILE
- VARIANT
- DATE
- REVISION
- SHEET
- /
- PROJECT
- SIZE

### Library data of the parts
C19-C21 = CMP-611-0027-24: as C14 on sheet DAC Output; Capacitor Type: Ceramic; RoHS: Yes; Mount: SMD; LCSC Part N.: C14663; Case/Package: 0603
CN14 = CMP-730-0003-11: as CN10 on sheet DAC Output; LCSC Part N.: C3176191; Orientation: Straight; Connector Type: BNC; Gender: Female
LED4 = CMP-520-0018-2: as LED1 on sheet DAC Output; Colour: White; LCSC Part N.: C34499; Mount: Surface Mount
Q4 = CMP-810-0002-2: as Q1 on sheet DAC Output; LCSC Part N.: C20917; Drain-Source Voltage (Vds): 30V; Mount: Surface Mount; PartNumber: AO3400A; Power Dissipation: 1.4W; Drain Current (Id): 5.7A; Polarity: N Channel
R23 = CMP-633-0013-26: 100mW Thick Film Resistors 75V ±100ppm/℃ ±1% 0603 Chip Resistor; PartNumber: 0603WAF1001T5E; Pick&PlaceFootprint: R0603; Number of Resistors: 1; Voltage Rating: 75V; Case/Package: 0603; Tolerance: 1%; Mount: Surface Mount; LCSC Part N.: C21190; Power Rating: 100mW
R24 = CMP-633-0105-10: 100mW Thick Film Resistors 75V ±100ppm/℃ ±1% 0603 Chip Resistor; PartNumber: 0603WAF3302T5E; Pick&PlaceFootprint: R0603; Number of Resistors: 1; Tolerance: 1%; Mount: Surface Mount; Voltage Rating: 75V; LCSC Part N.: C4216; Case/Package: 0603; Power Rating: 100mW
R25 = CMP-633-0107-3: 100mW Thick Film Resistors 75V ±100ppm/℃ ±1% 0603 Chip Resistor; PartNumber: 0603WAF6802T5E; Pick&PlaceFootprint: R0603; Number of Resistors: 1; Tolerance: 1%; LCSC Part N.: C23231; Case/Package: 0603; Power Rating: 100mW; Mount: Surface Mount; Voltage Rating: 75V
R26 R27 = CMP-633-0000-28: as R8 on sheet DAC Output; LCSC Part N.: C25803; Mount: Surface Mount; Voltage Rating: 75V; Power Rating: 100mW; Case/Package: 0603; Tolerance: 1%
R28 = CMP-633-0087-12: 100mW Thick Film Resistors 75V ±100ppm/℃ ±1% 0603 Chip Resistor; PartNumber: 0603WAF6800T5E; Number of Resistors: 1; Pick&PlaceFootprint: R0603; Voltage Rating: 75V; Case/Package: 0603; Power Rating: 100mW; Tolerance: 1%; Mount: Surface Mount; LCSC Part N.: C23228
U8 = CMP-9A0-0003-1: as U4 on sheet DAC Output; LCSC Part N.: C579118
U9 = CMP-941-0002-4: as U5 on sheet DAC Output; LCSC Part N.: C459905

## Sheet Digital IO HS.SchDoc
size 297 x 209 mm; CompanyName: Sainsbury Wellcome Centre; Organization: FabLab; Address1: Sainsbury Wellcome Centre; Address2: 25 Howland Street; Address3: London; Address4: W1T 4JG; DocumentNumber: 7; SheetNumber: 7; SheetTotal: 12; swcgroup: FabLab; Org: Sainsbury Wellcome Centre; Add1: 25 Howland Street; Add2: London; Add3: W1T 4JG; WebAddress: www.sainsburywellcome.org; SheetSize: A4; SheetName: Level Shifter
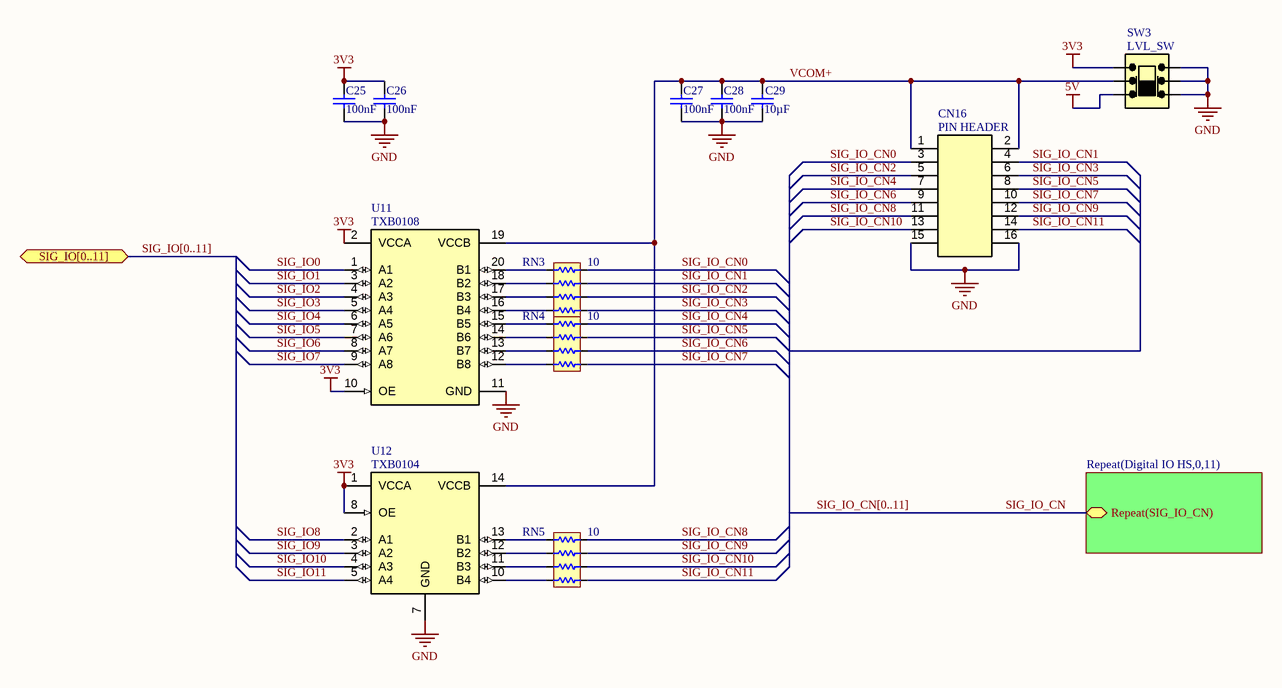
[diagram p5: Digital IO HS.SchDoc]

### Parts
C25  value 100nF  [CAP_CHIP_0603]  (hidden comment: C0603-100nF-50V)
C26  value 100nF  [CAP_CHIP_0603]  (hidden comment: C0603-100nF-50V)
C27  value 100nF  [CAP_CHIP_0603]  (hidden comment: C0603-100nF-50V)
C28  value 100nF  [CAP_CHIP_0603]  (hidden comment: C0603-100nF-50V)
C29  value 10µF  [CAP_CHIP_0603]  (hidden comment: C0603-10uF-35V)
CN16  PIN HEADER  [PIN_2.54_2X8P]
RN3  value 10  [RES_ARRAY_0603]  (hidden comment: RN0603-10R)
RN4  value 10  [RES_ARRAY_0603]  (hidden comment: RN0603-10R)
RN5  value 10  [RES_ARRAY_0603]  (hidden comment: RN0603-10R)
SW3  LVL_SW  [SW_SLIDE_OS202013MT8]
U11  TXB0108  [TSSOP20_6.5X4.4_0.65E]
U12  TXB0104  [TSSOP14_5X4.4_0.65E]

### Sub-sheets
Repeat(Digital IO HS,0,11) = Digital IO Connector.SchDoc (file not in this document): Repeat(SIG_IO_CN) (bidir)

### Ports
SIG_IO[0..11] (bidir)

### Nets
3V3: C25.2 C26.2 SW3.3(NOA) U11.2(VCCA) U11.10(OE) U12.1(VCCA) U12.8(OE)
5V: SW3.1(NCA)
GND: C25.1 C26.1 C27.1 C28.1 C29.1 CN16.15 CN16.16 SW3.4(NCB) SW3.5(COMB) SW3.6(NOB) U11.11(GND) U12.7(GND)
SIG_IO0: U11.1(A1)
SIG_IO1: U11.3(A2)
SIG_IO2: U11.4(A3)
SIG_IO3: U11.5(A4)
SIG_IO4: U11.6(A5)
SIG_IO5: U11.7(A6)
SIG_IO6: U11.8(A7)
SIG_IO7: U11.9(A8)
SIG_IO8: U12.2(A1)
SIG_IO9: U12.3(A2)
SIG_IO10: U12.4(A3)
SIG_IO11: U12.5(A4)
SIG_IO_CN: sheet Repeat(Digital IO HS,0,11)/Repeat(SIG_IO_CN)
SIG_IO_CN0: CN16.3 RN3.8
SIG_IO_CN1: CN16.4 RN3.7
SIG_IO_CN2: CN16.5 RN3.6
SIG_IO_CN3: CN16.6 RN3.5
SIG_IO_CN4: CN16.7 RN4.8
SIG_IO_CN5: CN16.8 RN4.7
SIG_IO_CN6: CN16.9 RN4.6
SIG_IO_CN7: CN16.10 RN4.5
SIG_IO_CN8: CN16.11 RN5.8
SIG_IO_CN9: CN16.12 RN5.7
SIG_IO_CN10: CN16.13 RN5.6
SIG_IO_CN11: CN16.14 RN5.5
VCOM+: C27.2 C28.2 C29.2 CN16.1 CN16.2 SW3.2(COMA) U11.19(VCCB) U12.14(VCCB)
NetRN3_1: RN3.1 U11.20(B1)
NetRN3_2: RN3.2 U11.18(B2)
NetRN3_3: RN3.3 U11.17(B3)
NetRN3_4: RN3.4 U11.16(B4)
NetRN4_1: RN4.1 U11.15(B5)
NetRN4_2: RN4.2 U11.14(B6)
NetRN4_3: RN4.3 U11.13(B7)
NetRN4_4: RN4.4 U11.12(B8)
NetRN5_1: RN5.1 U12.13(B1)
NetRN5_2: RN5.2 U12.12(B2)
NetRN5_3: RN5.3 U12.11(B3)
NetRN5_4: RN5.4 U12.10(B4)

### Buses and harness runs
bus SIG_IO[0..11] = port SIG_IO[0..11]
bus SIG_IO_CN[0..11]

### Notes on the sheet
- FILE
- VARIANT
- DATE
- REVISION
- SHEET
- /
- PROJECT
- SIZE

### Library data of the parts
C25-C28 = CMP-611-0027-24: as C14 on sheet DAC Output; Capacitor Type: Ceramic; RoHS: Yes; Mount: SMD; LCSC Part N.: C14663; Case/Package: 0603
C29 = CMP-611-0048-3: as C45 on sheet DC DC; Dielectric: X5R; Capacitor Type: Ceramic; Mount: SMD; LCSC Part N.: C194427; RoHS: Yes; Tolerance: 20%; Voltage Rating: 35V; Case/Package: 0603
CN16 = CMP-380-0031-5: Straight Policy 2.5mm 6mm -40℃~+105℃ 3mm 2.54mm Double Row Black Brass 2.54mm Plugin,P=2.54mm Pin Headers; PartNumber: PZ254V-12-16P; Number of Contacts: 16; Gender: Male; Number of Positions: 8; Mount: Through Hole; Pitch: 2.54mm; Number of Rows: 2; LCSC Part N.: C492425; Orientation: Straight
RN3-RN5 = CMP-633-0183-1: Array/Network Resistor, Jumper, Metal Glaze/thick Film, 10ohm, 50V, 5% +/-Tol, -200,200ppm/Cel, Surface Mount, 1206; PartNumber: 4D03WGJ0100T5E; Element Power Dissipation: 62.5mW; Number of Resistors: 4; Pick&PlaceFootprint: R0603x4; LCSC Part N.: C11993; Voltage Rating: 50V; Power Rating: 62.5mW; Tolerance: 5%; Case/Package: 0612; Mount: SMD; RoHS: Yes
SW3 = CMP-B00-0028-1: as SW1 on sheet DAC Output; Throw Configuration: DPDT; Orientation: Straight; LCSC Part N.: C2799227
U11 = CMP-950-0024-1: 8-Bit Bidirectional Voltage-Level Shifter with Auto Direction Sensing and +/-15-kV ESD Protect 20-TSSOP -40 to 85; PartNumber: TXB0108PWR; Data Rate: 100Mbps; Output Type: 3-STATE; Number of Channels: 8; Min Supply Voltage: 1.2V; Max Supply Voltage: 5.5V; Propagation Delay: 4ns; Channel Type: Bidirectional; LCSC Part N.: C53406
U12 = CMP-950-0006-5: 4-Bit Bidirectional Voltage-Level Shifter with Auto Direction Sensing and +/-15 kV ESD Protect 14-TSSOP -40 to 85; Max Supply Voltage: 5.5V; Min Supply Voltage: 1.2V; Propagation Delay: 31ns; LCSC Part N.: C60708; Channel Type: Bidirectional; PartNumber: TXB0104PWR

## Sheet DAC Amplifier.SchDoc
size 297 x 209 mm; CompanyName: Sainsbury Wellcome Centre; Organization: FabLab; Address1: Sainsbury Wellcome Centre; Address2: 25 Howland Street; Address3: London; Address4: W1T 4JG; DocumentNumber: 12; SheetNumber: 12; SheetTotal: 12; swcgroup: FabLab; Org: Sainsbury Wellcome Centre; Add1: 25 Howland Street; Add2: London; Add3: W1T 4JG; WebAddress: www.sainsburywellcome.org; SheetSize: A4; SheetName: Level Shifter
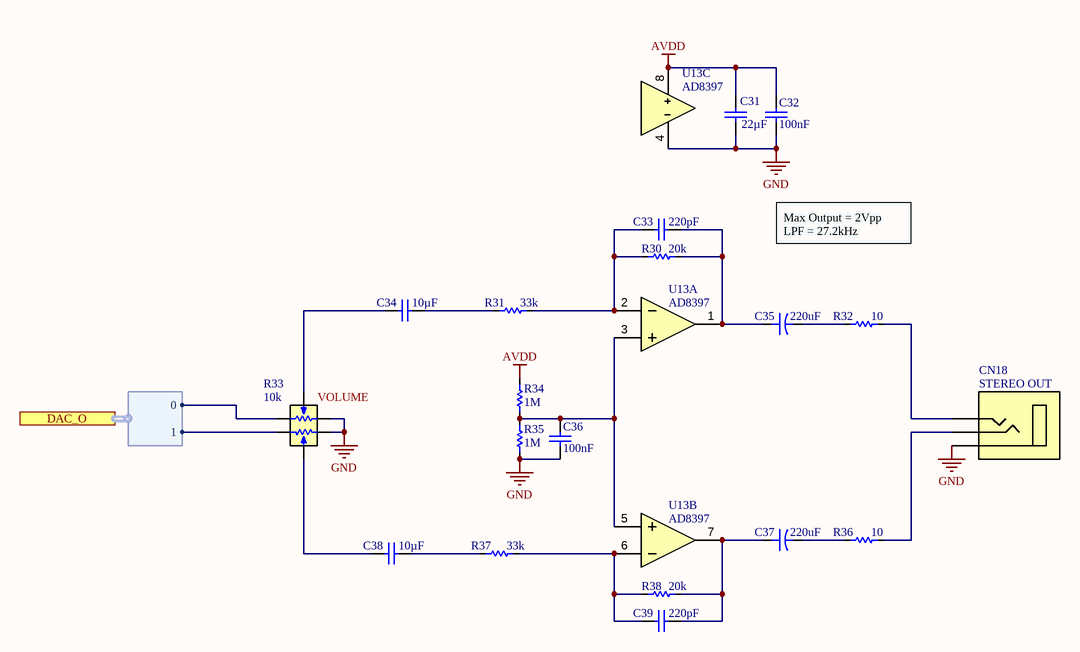
[diagram p6: DAC Amplifier.SchDoc]

### Parts
C31  value 22µF  [CAP_CHIP_0805]  (hidden comment: C0805-22uF-25V)
C32  value 100nF  [CAP_CHIP_0603]  (hidden comment: C0603-100nF-50V)
C33  value 220pF  [CAP_CHIP_0603]  (hidden comment: C0603-220pF-50V)
C34  value 10µF  [CAP_CHIP_0603]  (hidden comment: C0603-10uF-25V)
C35  value 220uF  [ECAP_SMD_6.3X5.4]  (hidden comment: EC63-220uF-10V)
C36  value 100nF  [CAP_CHIP_0603]  (hidden comment: C0603-100nF-50V)
C37  value 220uF  [ECAP_SMD_6.3X5.4]  (hidden comment: EC63-220uF-10V)
C38  value 10µF  [CAP_CHIP_0603]  (hidden comment: C0603-10uF-25V)
C39  value 220pF  [CAP_CHIP_0603]  (hidden comment: C0603-220pF-50V)
CN18  STEREO OUT  [PJ-3920]
R30  value 20k  [RES_CHIP_0603]  (hidden comment: R0603-20K)
R31  value 33k  [RES_CHIP_0603]  (hidden comment: R0603-33K)
R32  value 10  [RES_CHIP_1206]  (hidden comment: R1206-10R)
R33  VOLUME  value 10k  [VR_RK12L12C]
R34  value 1M  [RES_CHIP_0603]  (hidden comment: R0603-1M)
R35  value 1M  [RES_CHIP_0603]  (hidden comment: R0603-1M)
R36  value 10  [RES_CHIP_1206]  (hidden comment: R1206-10R)
R37  value 33k  [RES_CHIP_0603]  (hidden comment: R0603-33K)
R38  value 20k  [RES_CHIP_0603]  (hidden comment: R0603-20K)
U13  AD8397  [SOIC8_AD8397]  (parts A,B,C of 3)

### Ports
DAC_O (harness DAC_O)

### Harnesses
DAC_O: 1, 0

### Nets
AVDD: C31.2 C32.2 R34.2 U13.8(V+)
GND: C31.1 C32.1 C36.1 CN18.1(S) R33.1(TOP_A) R33.4(TOP_B) R35.1 U13.4(V-)
DAC_O.0: R33.2(BOT_A) ; port DAC_O.0
DAC_O.1: R33.5(BOT_B) ; port DAC_O.1
NetC33_1: C33.1 R30.1 R31.2 U13.2(A-)
NetC33_2: C33.2 C35.1 R30.2 U13.1(AOUT)
NetC34_1: C34.1 R33.3(TAP_A)
NetC34_2: C34.2 R31.1
NetC35_2: C35.2 R32.1
NetC36_2: C36.2 R34.1 R35.2 U13.3(A+) U13.5(B+)
NetC37_1: C37.1 C39.2 R38.2 U13.7(BOUT)
NetC37_2: C37.2 R36.1
NetC38_1: C38.1 R33.6(TAP_B)
NetC38_2: C38.2 R37.1
NetC39_1: C39.1 R37.2 R38.1 U13.6(B-)
NetCN18_2: CN18.2(T) R32.2
NetCN18_3: CN18.3(R) R36.2

### Notes on the sheet
- Max Output = 2Vpp
  LPF = 27.2kHz
- FILE
- VARIANT
- DATE
- REVISION
- SHEET
- /
- PROJECT
- SIZE

### Library data of the parts
C31 = CMP-611-0000-9: 0805 Multilayer Ceramic Capacitors MLCC; PartNumber: CL21A226MAQNNNE; Voltage Rating: 25V; Tolerance: 20%; Dielectric: X5R; Pick&PlaceFootprint: C0805; LCSC Part N.: C45783; Mount: SMD; RoHS: Yes; Capacitor Type: Ceramic; Case/Package: 0805
C32 C36 = CMP-611-0027-24: 0603 Multilayer Ceramic Capacitors MLCC; PartNumber: CC0603KRX7R9BB104; Pick&PlaceFootprint: C0603; Dielectric: X7R; Voltage Rating: 50V; Tolerance: 10%; Case/Package: 0603; Capacitor Type: Ceramic; LCSC Part N.: C14663; Mount: SMD; RoHS: Yes
C33 C39 = CMP-611-0075-1: 0603 Multilayer Ceramic Capacitors MLCC; PartNumber: CL10B221KB8NNNC; Dielectric: X7R; Pick&PlaceFootprint: C0603; Tolerance: 10%; Voltage Rating: 50V; LCSC Part N.: C1603; Case/Package: 0603; Capacitor Type: Ceramic; RoHS: Yes; Mount: SMD
C34 C38 = CMP-611-0050-6: 0603 Multilayer Ceramic Capacitors MLCC; PartNumber: CL10A106MA8NRNC; Dielectric: X5R; Voltage Rating: 25V; Tolerance: 20%; Pick&PlaceFootprint: C0603; Case/Package: 0603; Mount: SMD; LCSC Part N.: C96446; RoHS: Yes; Capacitor Type: Ceramic
C35 C37 = CMP-612-0008-1: 10µF ±20% 50V SMD Aluminum Electrolytic Capacitor Surface Mount D; PartNumber: CK1A221M-CRE54; Pick&PlaceFootprint: EC63; Voltage Rating: 10V; Mount: Surface Mount; Capacitor Type: Electrolytic; RoHS: Yes; Tolerance: 20%; LCSC Part N.: C18214277
CN18 = CMP-380-0042-2: 3.5mm Headphone Jack 30V 500mA Plugin Audio Connectors; PartNumber: PJ-3920-3A; Gender: Female; IEC Conformance: No; LCSC Part N.: C707259; Mount: Through Hole; Pitch: 3.5mm; Orientation: Vertical
R30 R38 = CMP-633-0126-1: 100mW Thick Film Resistors 75V ±100ppm/℃ ±1% 0603 Chip Resistor; PartNumber: 0603WAF2002T5E; Pick&PlaceFootprint: R0603; Number of Resistors: 1; Case/Package: 0603; Tolerance: 1%; Voltage Rating: 75V; Power Rating: 100mW; Mount: Surface Mount; LCSC Part N.: C4184
R31 R37 = CMP-633-0105-10: as R24 on sheet Analog Input Connector; Tolerance: 1%; Mount: Surface Mount; Voltage Rating: 75V; LCSC Part N.: C4216; Case/Package: 0603; Power Rating: 100mW
R32 R36 = CMP-633-0157-3: Res Thick Film 1206 10 Ohm 5% 0.75W(3/4W) ±200ppm/C Pad SMD Automotive T/R; PartNumber: CRCW120610R0JNEAHP; Pick&PlaceFootprint: 1206; Power Rating: 750mW; Number of Resistors: 1; Voltage Rating: 200V; Tolerance: 5%; Case/Package: 1206; Mount: Surface Mount; LCSC Part N.: C3008858
R33 = CMP-632-0007-2: Res POT 10K Ohm 20% 1(Elec)/1(Mech)Turns 6mm (13 X 28.5mm) Snap-In Panel Mount; PartNumber: RK12L12C0A0E; Power Rating: 50mW; Voltage Rating: 10V; Hole Diameter: 0.8mm; Type: Potentiometer; LCSC Part N.: C470285; Tolerance: 20%; RoHS: Yes; Mount: SMD
R34 R35 = CMP-633-0066-20: 100mW Thick Film Resistors 75V ±100ppm/℃ ±1% 0603 Chip Resistor; PartNumber: 0603WAF1004T5E; Number of Resistors: 1; Pick&PlaceFootprint: R0603; Voltage Rating: 75V; Mount: Surface Mount; LCSC Part N.: C22935; Power Rating: 100mW; Tolerance: 1%; Case/Package: 0603
U13 = CMP-941-0018-4: Op Amp Dual High Output Current Amplifier R-R O/P ±12.6V/25.2V 8-Pin SOIC N EP Tube; PartNumber: AD8397ARDZ; Quiescent Current: 11mA; Min Supply Voltage: 3V; PSRR: 95dB; Slew Rate: 53V/µs; Max Supply Voltage: 25.2V; Voltage Drift: 4.5µV/°C; Input Offset Voltage: 65µV; CMRR: 90dB; Gain Bandwidth: 69MHz; Max Output Current: 310mA; LCSC Part N.: C90876

## Sheet DAC Offset.SchDoc
size 297 x 209 mm; CompanyName: Sainsbury Wellcome Centre; Organization: FabLab; Address1: Sainsbury Wellcome Centre; Address2: 25 Howland Street; Address3: London; Address4: W1T 4JG; DocumentNumber: 10; SheetNumber: 10; SheetTotal: 12; swcgroup: FabLab; Org: Sainsbury Wellcome Centre; Add1: 25 Howland Street; Add2: London; Add3: W1T 4JG; WebAddress: www.sainsburywellcome.org; SheetSize: A4; SheetName: Level Shifter
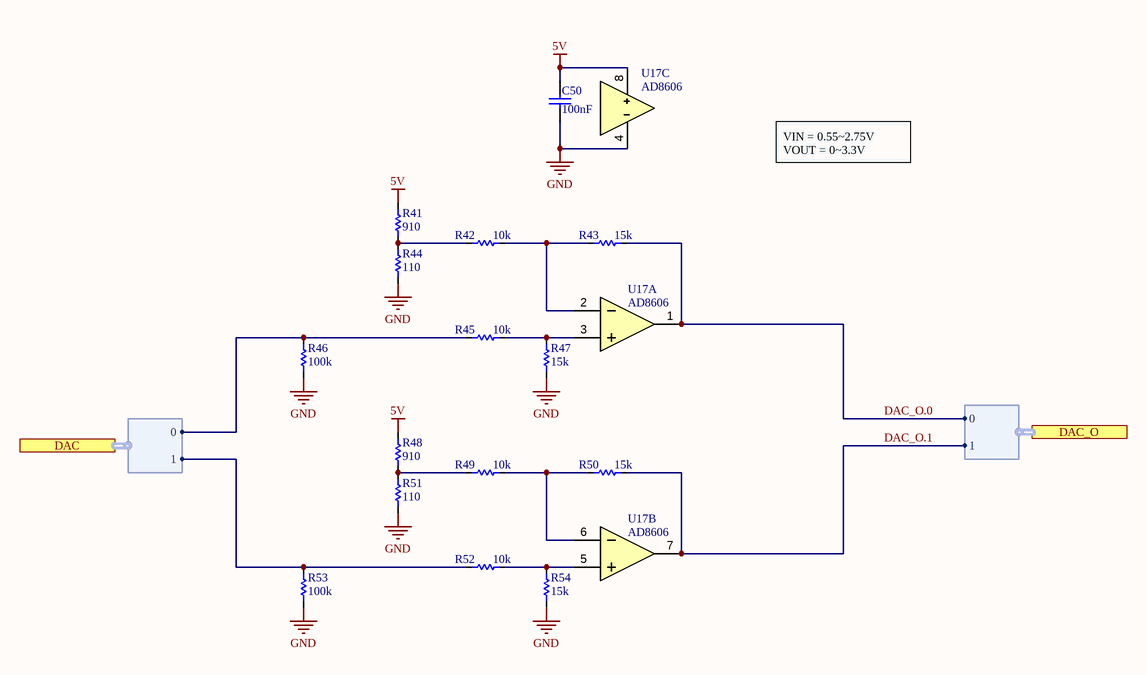
[diagram p7: DAC Offset.SchDoc]

### Parts
C50  value 100nF  [CAP_CHIP_0603]  (hidden comment: C0603-100nF-50V)
R41  value 910  [RES_CHIP_0603]  (hidden comment: R0603-910R)
R42  value 10k  [RES_CHIP_0603]  (hidden comment: R0603-10K)
R43  value 15k  [RES_CHIP_0603]  (hidden comment: R0603-15K)
R44  value 110  [RES_CHIP_0603]  (hidden comment: R0603-110R)
R45  value 10k  [RES_CHIP_0603]  (hidden comment: R0603-10K)
R46  value 100k  [RES_CHIP_0603]  (hidden comment: R0603-100K)
R47  value 15k  [RES_CHIP_0603]  (hidden comment: R0603-15K)
R48  value 910  [RES_CHIP_0603]  (hidden comment: R0603-910R)
R49  value 10k  [RES_CHIP_0603]  (hidden comment: R0603-10K)
R50  value 15k  [RES_CHIP_0603]  (hidden comment: R0603-15K)
R51  value 110  [RES_CHIP_0603]  (hidden comment: R0603-110R)
R52  value 10k  [RES_CHIP_0603]  (hidden comment: R0603-10K)
R53  value 100k  [RES_CHIP_0603]  (hidden comment: R0603-100K)
R54  value 15k  [RES_CHIP_0603]  (hidden comment: R0603-15K)
U17  AD8606  [VSSOP8_3X3_0.65E]  (parts A,B,C of 3)

### Ports
DAC (harness DAC), DAC_O (harness DAC_O)

### Harnesses
DAC: 1, 0
DAC_O: 1, 0

### Nets
5V: C50.2 R41.2 R48.2 U17.8(V+)
GND: C50.1 R44.1 R46.1 R47.1 R51.1 R53.1 R54.1 U17.4(V-)
DAC_O.0: R43.2 U17.1(AOUT) ; port DAC_O.0
DAC_O.1: R50.2 U17.7(BOUT) ; port DAC_O.1
NetR41_1: R41.1 R42.1 R44.2
NetR42_2: R42.2 R43.1 U17.2(A-)
NetR45_1: R45.1 R46.2 ; port DAC.0
NetR45_2: R45.2 R47.2 U17.3(A+)
NetR48_1: R48.1 R49.1 R51.2
NetR49_2: R49.2 R50.1 U17.6(B-)
NetR52_1: R52.1 R53.2 ; port DAC.1
NetR52_2: R52.2 R54.2 U17.5(B+)

### Notes on the sheet
- VIN = 0.55~2.75V
  VOUT = 0~3.3V
- FILE
- VARIANT
- DATE
- REVISION
- SHEET
- /
- PROJECT
- SIZE

### Library data of the parts
C50 = CMP-611-0027-24: as C14 on sheet DAC Output; Capacitor Type: Ceramic; RoHS: Yes; Mount: SMD; LCSC Part N.: C14663; Case/Package: 0603
R41 R48 = CMP-633-0088-12: 100mW Thick Film Resistors 75V ±100ppm/℃ ±1% 0603 Chip Resistor; PartNumber: HPCR0603F910RK9; Number of Resistors: 1; Pick&PlaceFootprint: R0603; LCSC Part N.: C365225; Case/Package: 0603; Tolerance: 1%; Mount: Surface Mount; Power Rating: 100mW; Voltage Rating: 75V
R42 R45 R49 R52 = CMP-633-0002-26: as R40 on sheet DC DC; Case/Package: 0603; Voltage Rating: 75V; Power Rating: 100mW; LCSC Part N.: C25804; Tolerance: 1%; Mount: Surface Mount
R43 R47 R50 R54 = CMP-633-0136-2: 100mW Thick Film Resistors 75V ±100ppm/℃ ±1% 0603 Chip Resistor; PartNumber: 0603WAF1502T5E; Pick&PlaceFootprint: R0603; Number of Resistors: 1; Power Rating: 100mW; Mount: Surface Mount; Voltage Rating: 75V; LCSC Part N.: C22809; Tolerance: 1%; Case/Package: 0603
R44 R51 = CMP-633-0080-13: 100mW Thick Film Resistors 75V ±100ppm/℃ ±1% 0603 Chip Resistor; PartNumber: RT0603BRD07110RL; Pick&PlaceFootprint: R0603; Number of Resistors: 1; Case/Package: 0603; Tolerance: 1%; Mount: Surface Mount; LCSC Part N.: C705717; Voltage Rating: 75V; Power Rating: 100mW
R46 R53 = CMP-633-0000-28: as R8 on sheet DAC Output; LCSC Part N.: C25803; Mount: Surface Mount; Voltage Rating: 75V; Power Rating: 100mW; Case/Package: 0603; Tolerance: 1%
U17 = CMP-941-0002-4: as U5 on sheet DAC Output; LCSC Part N.: C459905

## Nets that join several sheets
3V3: Analog Input A (SW4_1.4), Analog Input B (SW4_2.4), Digital IO HS (7 pins)
5V: DAC Output (11 pins), Analog Input A (R29_1.2 SW4_1.6), Analog Input A/Analog Input0 (5 pins), Analog Input A/Analog Input1 (5 pins), Analog Input A/Analog Input2 (5 pins), Analog Input A/Analog Input3 (5 pins), Analog Input A/Analog Input4 (5 pins), Analog Input A/Analog Input5 (5 pins), Analog Input B (R29_2.2 SW4_2.6), Analog Input B/Analog Input0 (5 pins), Analog Input B/Analog Input1 (5 pins), Analog Input B/Analog Input2 (5 pins), Analog Input B/Analog Input3 (5 pins), Analog Input B/Analog Input4 (5 pins), Analog Input B/Analog Input5 (5 pins), Digital IO HS (SW3.1), DAC Offset (C50.2 R41.2 R48.2 U17.8)
-3V3: DAC Output (C18.1 U6.4), Analog Input A/Analog Input0 (C21_1.1 U9_1.4), Analog Input A/Analog Input1 (C21_2.1 U9_2.4), Analog Input A/Analog Input2 (C21_3.1 U9_3.4), Analog Input A/Analog Input3 (C21_4.1 U9_4.4), Analog Input A/Analog Input4 (C21_5.1 U9_5.4), Analog Input A/Analog Input5 (C21_6.1 U9_6.4), Analog Input B/Analog Input0 (C21_7.1 U9_7.4), Analog Input B/Analog Input1 (C21_8.1 U9_8.4), Analog Input B/Analog Input2 (C21_9.1 U9_9.4), Analog Input B/Analog Input3 (C21_10.1 U9_10.4), Analog Input B/Analog Input4 (C21_11.1 U9_11.4), Analog Input B/Analog Input5 (C21_12.1 U9_12.4)
GND: DC DC (12 pins), DAC Output (22 pins), Analog Input A (C30_1.1 CN17_1.9 CN17_1.10 SW4_1.1), Analog Input A/Analog Input0 (8 pins), Analog Input A/Analog Input1 (8 pins), Analog Input A/Analog Input2 (8 pins), Analog Input A/Analog Input3 (8 pins), Analog Input A/Analog Input4 (8 pins), Analog Input A/Analog Input5 (8 pins), Analog Input B (C30_2.1 CN17_2.9 CN17_2.10 SW4_2.1), Analog Input B/Analog Input0 (8 pins), Analog Input B/Analog Input1 (8 pins), Analog Input B/Analog Input2 (8 pins), Analog Input B/Analog Input3 (8 pins), Analog Input B/Analog Input4 (8 pins), Analog Input B/Analog Input5 (8 pins), Digital IO HS (12 pins), DAC Amplifier (8 pins), DAC Offset (8 pins)
DAC_O.0: DAC Output (R11.2 U5.3), DAC Amplifier (R33.2), DAC Offset (R43.2 U17.1)
DAC_O.1: DAC Output (R14.2 U5.5), DAC Amplifier (R33.5), DAC Offset (R50.2 U17.7)
NetSW4_1_2: Analog Input A (SW4_1.2), Analog Input A/Analog Input0 (U8_1.1), Analog Input A/Analog Input1 (U8_2.1), Analog Input A/Analog Input2 (U8_3.1), Analog Input A/Analog Input3 (U8_4.1), Analog Input A/Analog Input4 (U8_5.1), Analog Input A/Analog Input5 (U8_6.1)
NetSW4_2_2: Analog Input B (SW4_2.2), Analog Input B/Analog Input0 (U8_7.1), Analog Input B/Analog Input1 (U8_8.1), Analog Input B/Analog Input2 (U8_9.1), Analog Input B/Analog Input3 (U8_10.1), Analog Input B/Analog Input4 (U8_11.1), Analog Input B/Analog Input5 (U8_12.1)
SIG_THRU_A0_Analog Input A: Analog Input A (CN17_1.3), Analog Input A/Analog Input0 (CN14_1.1 R24_1.2 U8_1.4)
SIG_THRU_A0_Analog Input B: Analog Input B (CN17_2.3), Analog Input B/Analog Input0 (CN14_7.1 R24_7.2 U8_7.4)
SIG_THRU_A1_Analog Input A: Analog Input A (CN17_1.4), Analog Input A/Analog Input1 (CN14_2.1 R24_2.2 U8_2.4)
SIG_THRU_A1_Analog Input B: Analog Input B (CN17_2.4), Analog Input B/Analog Input1 (CN14_8.1 R24_8.2 U8_8.4)
SIG_THRU_A2_Analog Input A: Analog Input A (CN17_1.5), Analog Input A/Analog Input2 (CN14_3.1 R24_3.2 U8_3.4)
SIG_THRU_A2_Analog Input B: Analog Input B (CN17_2.5), Analog Input B/Analog Input2 (CN14_9.1 R24_9.2 U8_9.4)
SIG_THRU_A3_Analog Input A: Analog Input A (CN17_1.6), Analog Input A/Analog Input3 (CN14_4.1 R24_4.2 U8_4.4)
SIG_THRU_A3_Analog Input B: Analog Input B (CN17_2.6), Analog Input B/Analog Input3 (CN14_10.1 R24_10.2 U8_10.4)
SIG_THRU_A4_Analog Input A: Analog Input A (CN17_1.7), Analog Input A/Analog Input4 (CN14_5.1 R24_5.2 U8_5.4)
SIG_THRU_A4_Analog Input B: Analog Input B (CN17_2.7), Analog Input B/Analog Input4 (CN14_11.1 R24_11.2 U8_11.4)
SIG_THRU_A5_Analog Input A: Analog Input A (CN17_1.8), Analog Input A/Analog Input5 (CN14_6.1 R24_6.2 U8_6.4)
SIG_THRU_A5_Analog Input B: Analog Input B (CN17_2.8), Analog Input B/Analog Input5 (CN14_12.1 R24_12.2 U8_12.4)